# EAGLE board base (EAGLE 9.2.1), part 1 of 3
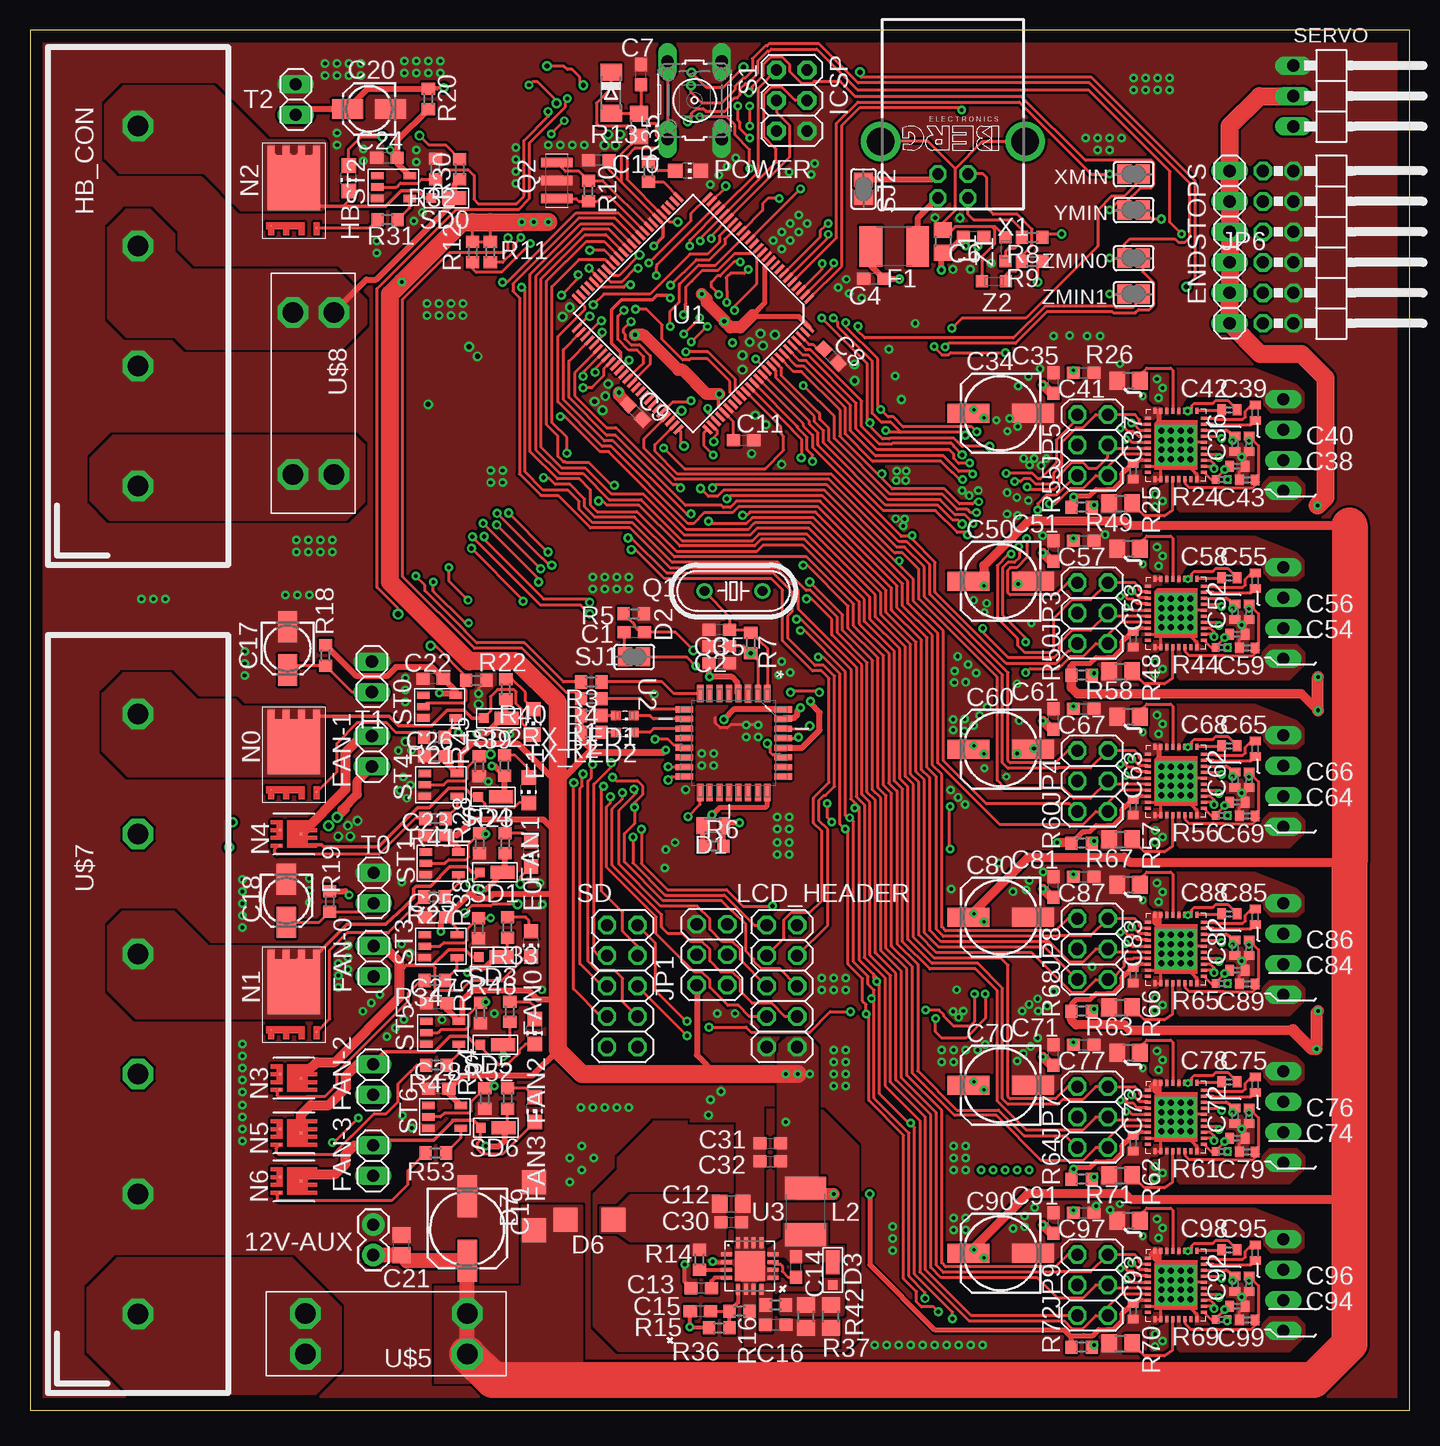
[diagram p5: board, top side]
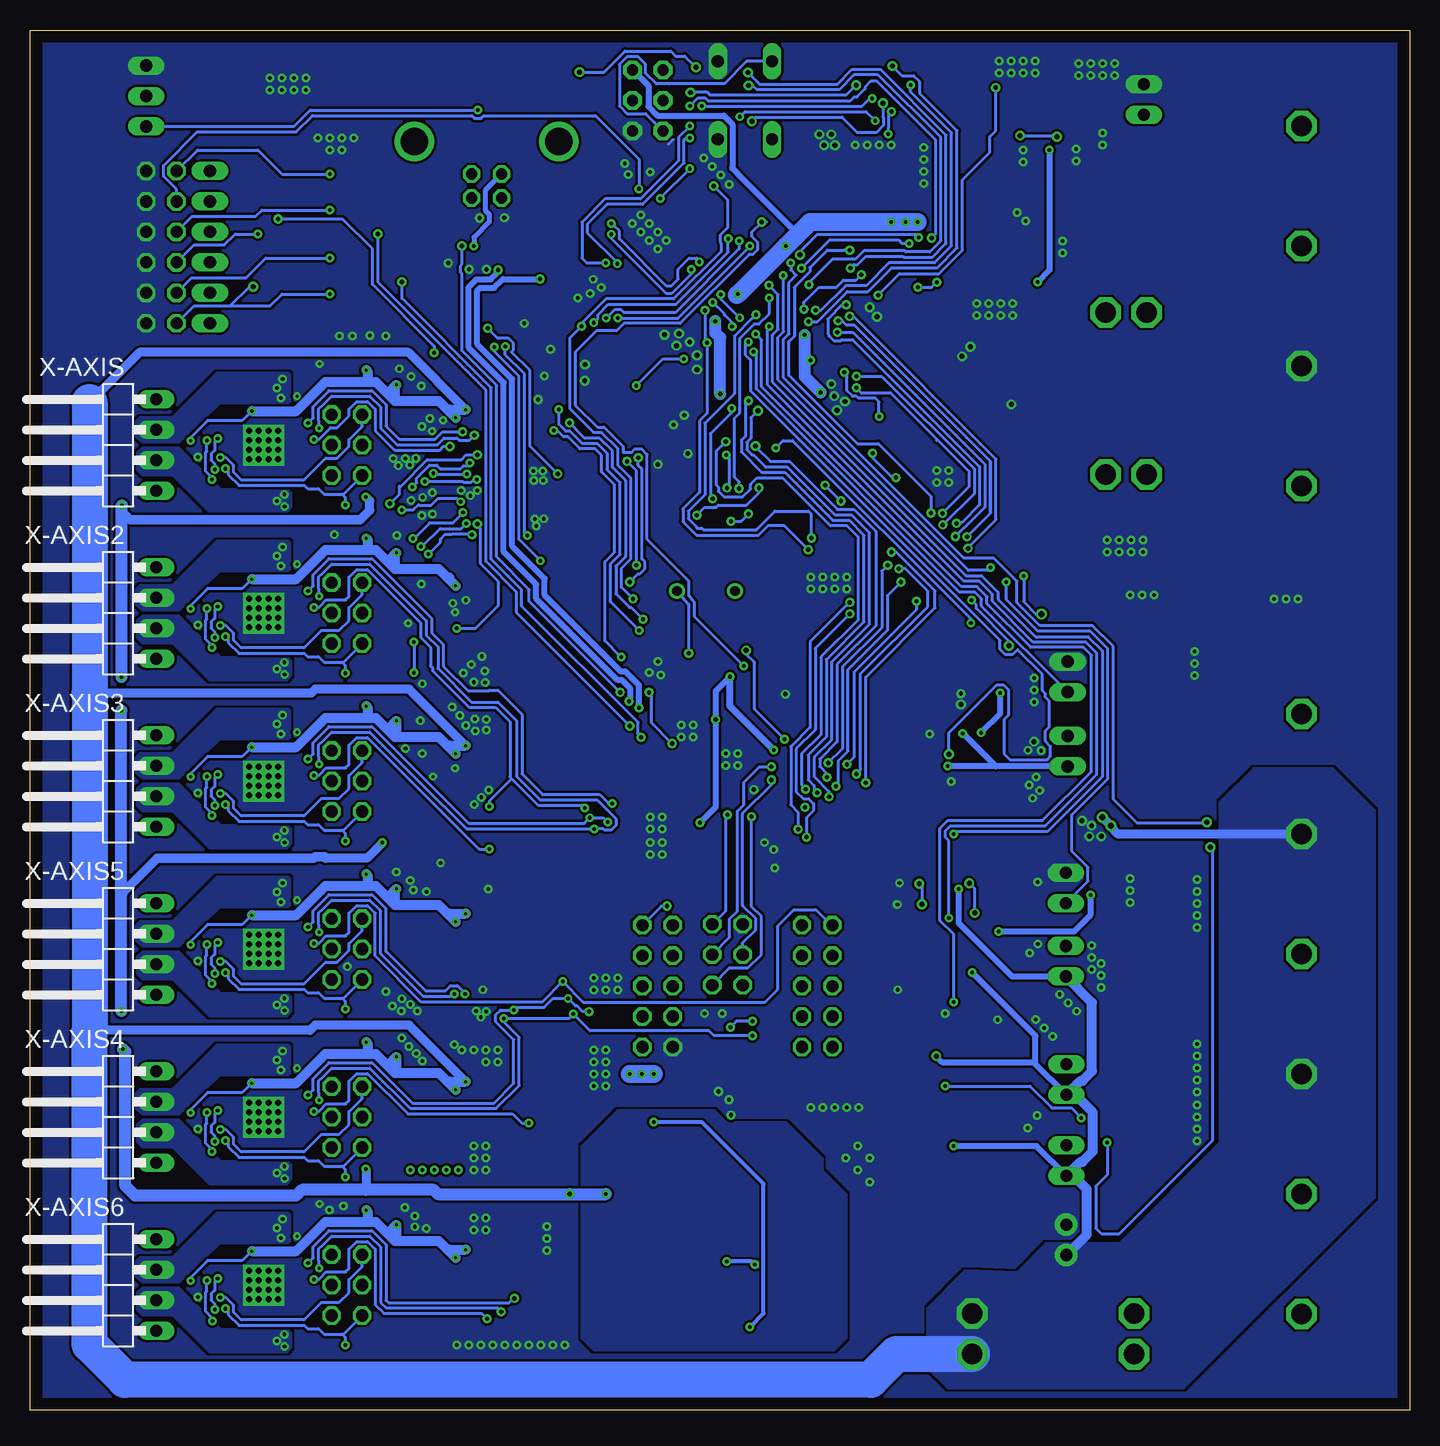
[diagram p6: board, bottom side, seen from below]

Size 115 x 115 mm. Coordinates in mm from the lower left corner, seen from the top.
Outline: 0,0 115,0 115,115 0,115 0,0
Copper layers (1*16): Top 0.035mm / dielectric 1.5mm / Bottom 0.035mm
Design rules "default": minimum track width 6mil, minimum drill 0.35mm, track to track 6mil, track to pad 6mil, pad to pad 6mil, via to via 6mil, smd to smd 6mil, copper to edge 40mil, drill to drill 6mil, minimum pad ring 10mil, minimum via ring 8mil, stop-mask expansion 4mil, vias tented up to drill 0mil, thermal gap 10mil
Net classes: 0 default: width 0.203 mm, drill 0.3 mm, clearance 0.203 mm; 2 gnd: width 0.305 mm, drill 0.406 mm, clearance 0.203 mm; 3 power usb: width 0.508 mm, drill 0.406 mm, clearance 0.203 mm

## Footprints (pad centres in the part's own frame; a part is rotated, then mirrored left to right if it is on the bottom)
1X02 = drill 1.016 pad 1.88: 1 0,0; 2 2.54,0
C0603 = smd 1.1 x 1: 1 -0.85,0; 2 0.85,0
C0805 = smd 1.3 x 1.5: 1 -0.95,0; 2 0.95,0
153CLV-0405 = smd 2.6 x 1.6: + 1.8,0; - -1.8,0
153CLV-0605 = smd 3.5 x 1.6: + 2.7,0; - -2.7,0
C0805' = smd 1.3 x 1.5: 1 -0.85,0; 2 0.85,0
C0402 = smd 0.7 x 0.9: 1 -0.65,0; 2 0.65,0
MICROMELF-W = smd 0.9 x 1.4: A 0.95,0; C -0.95,0
MINIMELF = smd 1.4 x 1.8: A 1.7,0; C -1.7,0
MICROSMP = smd 2 x 1.1: P$1 -1,0 | smd 0.8 x 0.8: P$2 0.9,0
SMA = smd 2 x 2: A -2,0; C 2,0
CHIP-LED0805 = smd 1.2 x 1.2: A 0,-1.05; C 0,1.05
2X06/90 = drill 1.016 octagon: 1 -6.35,-6.35; 2 -6.35,-3.81; 3 -3.81,-6.35; 4 -3.81,-3.81; 5 -1.27,-6.35; 6 -1.27,-3.81; 7 1.27,-6.35; 8 1.27,-3.81; 9 3.81,-6.35; 10 3.81,-3.81; 11 6.35,-6.35; 12 6.35,-3.81
L1812 = smd 1.9 x 3.4: 1 -1.95,0; 2 1.95,0
1X02' = drill 1.016 long: 1 -1.27,0; 2 1.27,0
POWER_CON_4 = drill 1.7 octagon: 1 -15,0; 2 -5,0; 3 5,0; 4 15,0
2X03 = drill 0.95 pad 1.55 octagon: 1 -2.54,-1.27; 2 -2.54,1.27; 3 0,-1.27; 4 0,1.27; 5 2.54,-1.27; 6 2.54,1.27
2X03' = drill 1.016 octagon: 1 -2.54,-1.27; 2 -2.54,1.27; 3 0,-1.27; 4 0,1.27; 5 2.54,-1.27; 6 2.54,1.27
1X06 = drill 1.016 long: 1 -6.35,0; 2 -3.81,0; 3 -1.27,0; 4 1.27,0; 5 3.81,0; 6 6.35,0
R0805 = smd 1.3 x 1.5: 1 -0.95,0; 2 0.95,0
2X05 = drill 1.016 octagon: 1 -5.08,-1.27; 2 -5.08,1.27; 3 -2.54,-1.27; 4 -2.54,1.27; 5 0,-1.27; 6 0,1.27; 7 2.54,-1.27; 8 2.54,1.27; 9 5.08,-1.27; 10 5.08,1.27
TDSON-8FL = smd 0.6 x 0.8: D -1.905,4.95; P$2 1.905,4.95; P$3 -0.635,4.95; P$4 0.635,4.95 | smd 0.1 x 0.1: G 1.9,-1.5; S -1.9,-1.3 | smd 4.41 x 4.55: P$5 0,2.275
TSDSON-8 = smd 0.2 x 0.2: D 0,0.585; G 0.955,-1.15; S -0.345,-1.15
HC49/S = drill 0.813: 1 -2.413,0; 2 2.413,0
CSTCR6M = smd 0.8 x 2.6: 1 -1.5,0; 2 0,0; 3 1.5,0
R0603 = smd 1 x 1.1: 1 -0.85,0; 2 0.85,0
R0402 = smd 0.6 x 0.7: 1 -0.5,0; 2 0.5,0
SML0603 = smd 0.8 x 0.8: A 0.75,0; C -0.75,0
B3F-10XX = drill 1.016 long: 1 -3.251,2.261; 2 3.251,2.261; 3 -3.251,-2.261; 4 3.251,-2.261
1X03/90 = drill 1.016 long: 1 -2.54,-3.81; 2 0,-3.81; 3 2.54,-3.81
SJ = smd 1.168 x 1.6: 1 -0.762,0; 2 0.762,0
SOT23-5 = smd 0.6 x 1.05: P$1 -0.95,-1.35; P$2 0,-1.35; P$3 0.95,-1.35; P$4 0.95,1.35; P$5 -0.95,1.35
100TQFP-ATMEGA2560 = smd 1 x 0.28: P$1 -7.7,6; P$2 -7.7,5.5; P$3 -7.7,5; P$4 -7.7,4.5; P$5 -7.7,4; P$6 -7.7,3.5; P$7 -7.7,3; P$8 -7.7,2.5; P$9 -7.7,2; P$10 -7.7,1.5; P$11 -7.7,1; P$12 -7.7,0.5; P$13 -7.7,0; P$14 -7.7,-0.5; P$15 -7.7,-1; P$16 -7.7,-1.5; P$17 -7.7,-2; P$18 -7.7,-2.5; P$19 -7.7,-3; P$20 -7.7,-3.5; P$21 -7.7,-4; P$22 -7.7,-4.5; P$23 -7.7,-5; P$24 -7.7,-5.5; P$25 -7.7,-6; P$51 7.7,-6; P$52 7.7,-5.5; P$53 7.7,-5; P$54 7.7,-4.5; P$55 7.7,-4; P$56 7.7,-3.5; P$57 7.7,-3; P$58 7.7,-2.5; P$59 7.7,-2; P$60 7.7,-1.5; P$61 7.7,-1; P$62 7.7,-0.5; P$63 7.7,0; P$64 7.7,0.5; P$65 7.7,1; P$66 7.7,1.5; P$67 7.7,2; P$68 7.7,2.5; P$69 7.7,3; P$70 7.7,3.5; P$71 7.7,4; P$72 7.7,4.5; P$73 7.7,5; P$74 7.7,5.5; P$75 7.7,6 | smd 0.28 x 1: P$26 -6,-7.7; P$27 -5.5,-7.7; P$28 -5,-7.7; P$29 -4.5,-7.7; P$30 -4,-7.7; P$31 -3.5,-7.7; P$32 -3,-7.7; P$33 -2.5,-7.7; P$34 -2,-7.7; P$35 -1.5,-7.7; P$36 -1,-7.7; P$37 -0.5,-7.7; P$38 0,-7.7; P$39 0.5,-7.7; P$40 1,-7.7; P$41 1.5,-7.7; P$42 2,-7.7; P$43 2.5,-7.7; P$44 3,-7.7; P$45 3.5,-7.7; P$46 4,-7.7; P$47 4.5,-7.7; P$48 5,-7.7; P$49 5.5,-7.7; P$50 6,-7.7; P$76 6,7.7; P$77 5.5,7.7; P$78 5,7.7; P$79 4.5,7.7; P$80 4,7.7; P$81 3.5,7.7; P$82 3,7.7; P$83 2.5,7.7; P$84 2,7.7; P$85 1.5,7.7; P$86 1,7.7; P$87 0.5,7.7; P$88 0,7.7; P$89 -0.5,7.7; P$90 -1,7.7; P$91 -1.5,7.7; P$92 -2,7.7; P$93 -2.5,7.7; P$94 -3,7.7; P$95 -3.5,7.7; P$96 -4,7.7; P$97 -4.5,7.7; P$98 -5,7.7; P$99 -5.5,7.7; P$100 -6,7.7
QFP80P900X900X120-32N = smd 1.473 x 0.508: 1 -4.115,2.794; 2 -4.115,2.007; 3 -4.115,1.194; 4 -4.115,0.406; 5 -4.115,-0.406; 6 -4.115,-1.194; 7 -4.115,-2.007; 8 -4.115,-2.794; 17 4.115,-2.794; 18 4.115,-2.007; 19 4.115,-1.194; 20 4.115,-0.406; 21 4.115,0.406; 22 4.115,1.194; 23 4.115,2.007; 24 4.115,2.794 | smd 0.508 x 1.473: 9 -2.794,-4.115; 10 -2.007,-4.115; 11 -1.194,-4.115; 12 -0.406,-4.115; 13 0.406,-4.115; 14 1.194,-4.115; 15 2.007,-4.115; 16 2.794,-4.115; 25 2.794,4.115; 26 2.007,4.115; 27 1.194,4.115; 28 0.406,4.115; 29 -0.406,4.115; 30 -1.194,4.115; 31 -2.007,4.115; 32 -2.794,4.115
16QFN = smd 0.896 x 0.32: 2 -1.937,0.325; BOOT 1.937,0.325; DIS 1.937,-0.325; LX 1.937,0.975; SGND 1.937,-0.975; SS -1.937,-0.975; TON -1.937,-0.325; VIN -1.937,0.975 | smd 0.32 x 0.896: 7 0.325,-1.937; 13 0.975,1.937; 14 0.325,1.937; 15 -0.325,1.937; 16 -0.975,1.937; FB -0.975,-1.937; GND -0.325,-1.937; ISEN 0.975,-1.937 | smd 2.5 x 2.5: PAD 0,0
36QFN-TRINAMIC2130 = smd 0.5 x 0.25: 5VOUT 2.35,0.75; - -2.35,-1.75; AIN_IREF 2.35,-0.25; CLK -2.35,2.25; CPI 2.35,2.25; CPO 2.35,1.75; CSN_CFG3 -2.35,1.75; DCIN_CFG5 2.35,-2.25; DIAG0 2.35,-1.75; DIAG1 2.35,-1.25; DIR -2.35,-0.75; DRV_ENN_CFG6 2.35,-0.75; GNDA 2.35,0.25; SCK_CFG2 -2.35,1.25; SDI_CFG1 -2.35,0.75; SDO_CFG0 -2.35,0.25; SPI_MODE -2.35,-2.25; STEP -2.35,-0.25; VCC 2.35,1.25; VCC_IO -2.35,-1.25 | smd 0.25 x 0.5: BRA -0.25,2.85; BRB -0.25,-2.85; DCEN_CFG4 1.75,-2.85; DCO 1.25,-2.85; GNDP1 -1.25,-2.85; GNDP2 -1.25,2.85; NC2 -1.75,-2.85; OA1 -0.75,2.85; OA2 0.25,2.85; OB1 -0.75,-2.85; OB2 0.25,-2.85; TST_MODE -1.75,2.85; VCP 1.75,2.85; VS1 0.75,-2.85; VS2 0.75,2.85; VSA 1.25,2.85 | smd 0.406 x 0.203: GND 0,0 | drill 0.5 pad 0.8 square: P$37 -1.2,1.2; P$38 -0.4,1.2; P$39 0.4,1.2; P$40 1.2,1.2; P$41 -1.2,0.4; P$42 -0.4,0.4; P$43 0.4,0.4; P$44 1.2,0.4; P$45 -1.2,-0.4; P$46 -0.4,-0.4; P$47 0.4,-0.4; P$48 1.2,-0.4; P$49 -1.2,-1.2; P$50 -0.4,-1.2; P$51 0.4,-1.2; P$52 1.2,-1.2
UNIVAL_FUSE = drill 1.7 octagon: P$1 -6.75,1.7; P$2 6.75,1.7; P$3 -6.75,-1.7; P$4 6.75,-1.7
POWER_CON_6 = drill 1.7 octagon: 1 -25,0; 2 -15,0; 3 -5,0; 4 5,0; 5 15,0; 6 25,0
PN61729-S = drill 0.95 octagon: 1 1.25,4.71; 2 -1.25,4.71; 3 -1.25,2.71; 4 1.25,2.71 | drill 2.3 pad 2.9: S1 -6.02,0; S2 6.02,0
1X04/90 = drill 1.016 long: 1 -3.81,-3.81; 2 -1.27,-3.81; 3 1.27,-3.81; 4 3.81,-3.81
CT/CN0603 = smd 1 x 1: 1 -1,0; 2 1,0

## Placement (x,y rotation side)
12V-AUX  [1X02]  28.61,12.91 90 top
C1  100n  [C0603]  50.38,64.8 180 top
C2  22p  [C0603]  57.46,63.63 180 top
C3  22p  [C0603]  57.46,65.03 180 top
C4  100n/0603  [C0603]  70.35,94.26 180 top
C5  100n  [C0603]  57.46,62.23 0 top
C6  1u/0603  [C0603]  78.66,97.78 180 top
C7  22p  [C0603]  50.95,111.28 90 top
C8  100n/0603  [C0603]  66.78,87.82 315 top
C9  100n/0603  [C0603]  50.47,83.18 315 top
C10  100n/0603  [C0603]  47.41,104.14 180 top
C11  100n/0603  [C0603]  59.49,80.8 0 top
C12  2.2u/X5R  [C0805]  58.46,17.2 0 top
C13  47n  [C0603]  55.95,10.14 180 top
C14  22n  [C0603]  63.87,11.91 90 top
C15  10n  [C0603]  55.89,8.25 0 top
C16  1n  [C0603]  62.16,7.09 180 top
C17  10uF/>15V/ø4x 5.8  [153CLV-0405]  21.48,63.47 270 top
C18  10uF/>15V/ø4x 5.8  [153CLV-0405]  21.37,42.44 270 top
C19  100uF/50V/ø5  [153CLV-0605]  36.45,15.13 270 top
C20  10uF/>15V/ø4x 5.8  [153CLV-0405]  28.27,108.42 180 top
C21  100nF/0603  [C0805']  30.96,13.75 90 top
C22  100nv  [C0603]  33.61,60.95 180 top
C23  100n/0603  [C0603]  33.8,47.88 180 top
C24  100n/0603  [C0603]  29.76,104.34 180 top
C25  100n/0603  [C0603]  33.8,41.05 180 top
C26  100n/0603  [C0603]  33.75,54.5 180 top
C27  100n/0603  [C0603]  33.9,33.89 180 top
C28  100n/0603  [C0603]  34.07,26.77 180 top
C30  0.2u/X7R  [C0603]  58.45,15.63 0 top
C31  10u  [C0603]  61.7,22.23 0 top
C32  10u  [C0603]  61.7,20.71 0 top
C34  100uF  [153CLV-0605]  80.91,83.06 180 top
C35  100uF  [C0603]  85.32,85.58 90 top
C36  470n/10V  [C0402]  100.45,80.52 270 top
C37  100n/50V  [C0402]  91.96,78.24 270 top
C38  4n7/10V  [C0402]  100.64,78.65 0 top
C39  22n/50V  [C0402]  102.14,83.1 90 top
C40  100n/50V  [C0402]  101.62,80.52 270 top
C41  1u/50V  [C0603]  87.83,86.43 0 top
C42  100n/50V  [C0402]  99.99,83.35 0 top
C43  100n/50V  [C0402]  101.48,77.51 0 top
C50  100uF  [153CLV-0605]  80.91,69.06 180 top
C51  100uF  [C0603]  85.32,71.58 90 top
C52  470n/10V  [C0402]  100.45,66.52 270 top
C53  100n/50V  [C0402]  91.96,64.24 270 top
C54  4n7/10V  [C0402]  100.64,64.65 0 top
C55  22n/50V  [C0402]  102.14,69.1 90 top
C56  100n/50V  [C0402]  101.62,66.52 270 top
C57  1u/50V  [C0603]  87.83,72.43 0 top
C58  100n/50V  [C0402]  99.99,69.35 0 top
C59  100n/50V  [C0402]  101.48,63.51 0 top
C60  100uF  [153CLV-0605]  80.91,55.06 180 top
C61  100uF  [C0603]  85.32,57.58 90 top
C62  470n/10V  [C0402]  100.45,52.52 270 top
C63  100n/50V  [C0402]  91.96,50.24 270 top
C64  4n7/10V  [C0402]  100.64,50.65 0 top
C65  22n/50V  [C0402]  102.14,55.1 90 top
C66  100n/50V  [C0402]  101.62,52.52 270 top
C67  1u/50V  [C0603]  87.83,58.43 0 top
C68  100n/50V  [C0402]  99.99,55.35 0 top
C69  100n/50V  [C0402]  101.48,49.51 0 top
C70  100uF  [153CLV-0605]  80.91,27.06 180 top
C71  100uF  [C0603]  85.32,29.58 90 top
C72  470n/10V  [C0402]  100.45,24.52 270 top
C73  100n/50V  [C0402]  91.96,22.24 270 top
C74  4n7/10V  [C0402]  100.64,22.65 0 top
C75  22n/50V  [C0402]  102.14,27.1 90 top
C76  100n/50V  [C0402]  101.62,24.52 270 top
C77  1u/50V  [C0603]  87.83,30.43 0 top
C78  100n/50V  [C0402]  99.99,27.35 0 top
C79  100n/50V  [C0402]  101.48,21.51 0 top
C80  100uF  [153CLV-0605]  80.91,41.06 180 top
C81  100uF  [C0603]  85.32,43.58 90 top
C82  470n/10V  [C0402]  100.45,38.52 270 top
C83  100n/50V  [C0402]  91.96,36.24 270 top
C84  4n7/10V  [C0402]  100.64,36.65 0 top
C85  22n/50V  [C0402]  102.14,41.1 90 top
C86  100n/50V  [C0402]  101.62,38.52 270 top
C87  1u/50V  [C0603]  87.83,44.43 0 top
C88  100n/50V  [C0402]  99.99,41.35 0 top
C89  100n/50V  [C0402]  101.48,35.51 0 top
C90  100uF  [153CLV-0605]  80.91,13.06 180 top
C91  100uF  [C0603]  85.32,15.58 90 top
C92  470n/10V  [C0402]  100.45,10.52 270 top
C93  100n/50V  [C0402]  91.96,8.24 270 top
C94  4n7/10V  [C0402]  100.64,8.65 0 top
C95  22n/50V  [C0402]  102.14,13.1 90 top
C96  100n/50V  [C0402]  101.62,10.52 270 top
C97  1u/50V  [C0603]  87.83,16.43 0 top
C98  100n/50V  [C0402]  99.99,13.35 0 top
C99  100n/50V  [C0402]  101.48,7.51 0 top
D1  1206  [MICROMELF-W]  56.94,48.69 180 top
D2  1206  [MINIMELF]  48.45,109.77 270 top
D3  SCHOTTKY  [MICROSMP]  66.92,11.31 270 top
D6  MRA4004T3G  [SMA]  46.66,15.87 0 top
D7  MRA4004T3G  [SMA]  42.02,16.98 270 top
E0  [CHIP-LED0805]  41.77,46.34 180 top
E1  [CHIP-LED0805]  41.97,57.34 180 top
ENDSTOPS  [2X06/90]  109.13,96.91 270 top
F1  500mA/1812  [L1812]  72.04,96.97 180 top
FAN0  [CHIP-LED0805]  41.77,38.84 180 top
FAN1  [CHIP-LED0805]  41.57,51.65 180 top
FAN2  [CHIP-LED0805]  42.07,31.55 180 top
FAN3  [CHIP-LED0805]  42.07,25.05 180 top
FAN-0  [1X02']  28.65,37.4 90 top
FAN-1  [1X02']  28.5,54.9 90 top
FAN-2  [1X02']  28.6,27.53 90 top
FAN-3  [1X02']  28.6,20.78 90 top
HB  [CHIP-LED0805]  26.57,102.64 180 top
HB_CON  POWER_CON_4  [POWER_CON_4]  9,92 90 top
ICSP  3x2M  [2X03]  63.5,109.14 270 top
JP1  [2X03']  56.85,37.95 90 top
JP3  [2X03']  88.58,66.41 90 top
JP4  [2X03']  88.58,52.41 90 top
JP5  [2X03']  88.58,80.41 90 top
JP6  [1X06]  100.01,96.91 270 top
JP7  [2X03']  88.58,24.41 90 top
JP8  [2X03']  88.58,38.41 90 top
JP9  [2X03']  88.58,10.41 90 top
L1  BLM21PG221SH1D  [R0805]  76.09,97.38 270 top
L2  6.3u/1812  [L1812]  64.64,16.55 270 top
LCD_HEADER  [2X05]  62.68,35.33 270 top
N0  BSC010N04LS  [TDSON-8FL]  22,53 0 top
N1  BSC010N04LS  [TDSON-8FL]  22,33 0 top
N2  BSC010N04LS  [TDSON-8FL]  22,100 0 top
N3  BSZ0904NSIATMA1  [TSDSON-8]  22,27.65 270 top
N4  BSZ0904NSIATMA1  [TSDSON-8]  22,48 270 top
N5  BSZ0904NSIATMA1  [TSDSON-8]  22,23.08 270 top
N6  BSZ0904NSIATMA1  [TSDSON-8]  22,19.08 270 top
POWER  [CHIP-LED0805]  54.85,103.27 270 top
Q1  16Mhz  [HC49/S]  58.65,68.26 0 top
Q2  CSTCE16M0V53-R0 16MHZ  [CSTCR6M]  43.92,102.45 90 top
R1  1k/0603  [R0603]  46.78,57.87 180 top
R2  1k/0603  [R0603]  46.78,56.47 180 top
R3  1k/0603  [R0603]  46.78,60.67 180 top
R4  1k/0603  [R0603]  46.78,59.27 180 top
R5  1k/0603  [R0603]  50.33,66.35 180 top
R6  1k/0603  [R0603]  56.95,46.99 0 top
R7  1M/0603  [R0603]  60.09,63.9 270 top
R8  22/0603  [R0603]  83.55,97.73 180 top
R9  22/0603  [R0603]  83.53,95.73 180 top
R10  1M  [R0603]  46.55,101.6 270 top
R11  10k/0603  [R0603]  38.37,96.49 90 top
R12  10k/0603  [R0603]  36.9,96.49 90 top
R13  10k  [R0805]  50.75,107.07 270 top
R14  100k  [R0603]  55.8,12.52 270 top
R15  3.92K  [R0603]  57.46,6.85 0 top
R16  750R  [R0603]  59.14,8.23 0 top
R18  4.7K/0603  [R0603]  24.64,62.89 90 top
R19  4.7K/0603  [R0603]  24.99,42.39 90 top
R20  4.7K/0603  [R0603]  33.21,109.26 270 top
R21  100R/0603/1%  [R0603]  33.71,56.05 180 top
R22  4.7k/0603  [R0603]  37.21,60.8 180 top
R23  1.8K/0603  [R0603]  39.61,47.23 90 top
R24  2R2  [R0402]  99.33,77.53 180 top
R25  0R11/0805/0.1%  [R0805]  90.92,75.55 0 top
R26  0R11/0805/0.1%  [R0805]  91.57,85.78 0 top
R27  100R/0603/1%  [R0603]  33.7,42.75 180 top
R28  4.7k/0603  [R0603]  37.48,47.23 90 top
R30  1.8K/0603  [R0603]  35.82,103.4 90 top
R31  100R/0603/1%  [R0603]  29.81,99.19 180 top
R32  4.7k/0603  [R0603]  33.81,103.41 270 top
R33  1.8K/0603  [R0603]  39.8,40.22 90 top
R34  100R/0603/1%  [R0603]  33.75,35.8 180 top
R35  1K  [R0603]  51.56,103.19 270 top
R36  47R  [R0603]  62.15,8.75 0 top
R37  0R1/.1%/250mW  [R0805]  64.69,7.79 90 top
R38  4.7k/0603  [R0603]  37.4,40.15 90 top
R39  1.8K/0603  [R0603]  39.55,53.7 90 top
R40  1.8K/0603  [R0603]  39.66,60.06 90 top
R41  100R/0603/1%  [R0603]  33.8,49.3 180 top
R42  0R1/.1%/250mW  [R0805]  66.75,7.79 90 top
R44  2R2  [R0402]  99.33,63.53 180 top
R45  4.7k/0603  [R0603]  37.45,53.65 90 top
R46  1.8K/0603  [R0603]  40,33.19 90 top
R47  100R/0603/1%  [R0603]  33.89,28.74 180 top
R48  0R11  [R0805]  90.92,61.55 0 top
R49  0R11  [R0805]  91.57,71.78 0 top
R50  10K  [R0603]  87.67,61.24 0 top
R51  4.7k/0603  [R0603]  37.55,33.09 90 top
R52  1.8K/0603  [R0603]  39.82,25.97 90 top
R53  100R/0603/1%  [R0603]  33.82,21.42 180 top
R54  4.7k/0603  [R0603]  37.92,25.97 90 top
R55  10K  [R0603]  87.67,75.24 0 top
R56  2R2  [R0402]  99.33,49.53 180 top
R57  0R11  [R0805]  90.92,47.55 0 top
R58  0R11  [R0805]  91.57,57.78 0 top
R60  10K  [R0603]  87.67,47.24 0 top
R61  2R2  [R0402]  99.33,21.53 180 top
R62  0R11  [R0805]  90.92,19.55 0 top
R63  0R11  [R0805]  91.57,29.78 0 top
R64  10K  [R0603]  87.67,19.24 0 top
R65  2R2  [R0402]  99.33,35.53 180 top
R66  0R11  [R0805]  90.92,33.55 0 top
R67  0R11  [R0805]  91.57,43.78 0 top
R68  10K  [R0603]  87.67,33.24 0 top
R69  2R2  [R0402]  99.33,7.53 180 top
R70  0R11  [R0805]  90.92,5.55 0 top
R71  0R11  [R0805]  91.57,15.78 0 top
R72  10K  [R0603]  87.67,5.24 0 top
RX_LED1  [SML0603]  49.6,57.87 180 top
S1  [B3F-10XX]  55.4,109.14 270 top
SD  [2X05]  49.38,35.33 270 top
SD0  SCHOTTKY  [MICROSMP]  34.36,100.99 180 top
SD1  SCHOTTKY  [MICROSMP]  38.4,44.8 180 top
SD2  SCHOTTKY  [MICROSMP]  38.71,57.65 180 top
SD3  SCHOTTKY  [MICROSMP]  38.3,37.75 180 top
SD4  SCHOTTKY  [MICROSMP]  38.25,51.1 180 top
SD5  SCHOTTKY  [MICROSMP]  38.45,30.44 180 top
SD6  SCHOTTKY  [MICROSMP]  38.47,23.52 180 top
SERVO  [1X03/90]  109.13,109.5 270 top
SJ1  [SJ]  50.36,62.76 0 top
SJ2  [SJ]  69.48,101.76 270 top
ST0  SN74LVC1G17  [SOT23-5]  34.15,58.61 270 top
ST1  SN74LVC1G17  [SOT23-5]  34.36,45.55 270 top
ST2  SN74LVC1G17  [SOT23-5]  30.31,101.91 270 top
ST3  SN74LVC1G17  [SOT23-5]  34.25,38.65 270 top
ST4  SN74LVC1G17  [SOT23-5]  34.25,52.1 270 top
ST5  SN74LVC1G17  [SOT23-5]  34.4,31.44 270 top
ST6  SN74LVC1G17  [SOT23-5]  34.57,24.42 270 top
T0  [1X02']  28.65,43.5 270 top
T1  [1X02']  28.5,61.1 270 top
T2  [1X02']  22.15,109.2 270 top
TX_LED2  [SML0603]  49.6,56.47 180 top
U1  ATMEGA2560  [100TQFP-ATMEGA2560]  55.27,91.39 225 top
U2  ATMEGA16U2-AU  [QFP80P900X900X120-32N]  58.67,55.58 270 top
U3  A440316QFN  [16QFN]  60,12 0 top
U$2  TRINAMIC2130  [36QFN-TRINAMIC2130]  95.52,80.41 0 top
U$3  TRINAMIC2130  [36QFN-TRINAMIC2130]  95.52,52.41 0 top
U$4  TRINAMIC2130  [36QFN-TRINAMIC2130]  95.52,66.41 0 top
U$5  UNIVAL_FUSE  [UNIVAL_FUSE]  29.7,6.35 180 top
U$6  TRINAMIC2130  [36QFN-TRINAMIC2130]  95.52,24.41 0 top
U$7  POWER_CON_6  [POWER_CON_6]  9,33 90 top
U$8  UNIVAL_FUSE  [UNIVAL_FUSE]  23.62,84.72 270 top
U$9  TRINAMIC2130  [36QFN-TRINAMIC2130]  95.52,38.41 0 top
U$10  TRINAMIC2130  [36QFN-TRINAMIC2130]  95.52,10.41 0 top
X1  PN61729-S  [PN61729-S]  76.94,105.71 180 top
X-AXIS  [1X04/90]  108.29,80.41 90 bottom
X-AXIS2  [1X04/90]  108.29,66.41 90 bottom
X-AXIS3  [1X04/90]  108.29,52.41 90 bottom
X-AXIS4  [1X04/90]  108.29,24.41 90 bottom
X-AXIS5  [1X04/90]  108.29,38.41 90 bottom
X-AXIS6  [1X04/90]  108.29,10.41 90 bottom
XMIN  [SJ]  92,103 0 top
YMIN  [SJ]  92,100 0 top
Z1  VARISTORCN0603  [CT/CN0603]  81.33,96.75 90 top
Z2  VARISTORCN0603  [CT/CN0603]  80.37,94.06 180 top
ZMIN0  [SJ]  92,96 0 top
ZMIN1  [SJ]  92,93 0 top

## Tracks (layer width: path | path; a pad name or v marks a point on that pad's centre or on a via)
16U2_D+  (via drill 0.35)
  Top 0.25: U2.29 63.99,55.99 v64.06,56.06 | v84,94 84,95.34 R9.1
  Bottom 0.25: v84,94 84,92.64 76.55,85.19 76.55,70.9 74,68.35 74,67 64.29,57.29 64.29,56.29 v64.06,56.06
16U2_D-  (via drill 0.35)
  Top 0.25: U2.30 64.27,56.78 64.29,56.76 64.76,56.76 v65,57 | v86,98 84.68,98 R8.1
  Bottom 0.25: v86,98 86,94 77,85 77,70.71 74.45,68.17 74.45,66.45 v65,57
16U2_MISO  (via drill 0.35)
  Top 0.25: v54.85,49.45 55.87,50.47 U2.17
  Bottom 0.25: v54.85,49.45 54.85,41.94 54.04,41.13 54.04,37.95 55.13,36.86 56.67,36.86 JP1.1
16U2_MOSI  (via drill 0.35)
  Top 0.25: v53.2,52.5 53.49,52.79 U2.16
  Bottom 0.25: JP1.4 55.58,38.95 54.49,40.03 54.49,40.94 55.58,42.03 55.58,49.72 53.2,52.1 v53.2,52.5
16U2_RESET  (via drill 0.35)
  Top 0.25: 61.46,51 61.46,51.1 U2.24 | v56.86,49.6 56.9,49.6 56.95,49.65
  Top 0.4: R6.1 56.1,48.59 D1.A 56.95,49.65 57.52,50.22 61.3,50.22 61.46,50.38 61.46,51.1
  Bottom 0.25: JP1.5 57,41.61 57,49.46 v56.86,49.6
16U2_SCK  (via drill 0.35)
  Top 0.25: v53.2,53.6 54.53,53.6 U2.15
  Bottom 0.25: JP1.3 56.67,39.4 56.67,40.94 56.04,41.58 56.04,49.9 55.5,50.44 55.5,52.3 54.2,53.6 v53.2,53.6
16U2_XTAL1
  Top 0.25: Q1.1 58.31,66.06 C3.1 59.91,65.03 R7.1 61.46,63.48 U2.1
16U2_XTAL2  (via drill 0.35)
  Top 0.25: U2.2 60.67,62.47 R7.2 59.51,63.63 C2.1
  Bottom 0.25: Q1.2 60.09,67.16 R7.2
  other vias: 60.09,63.05
+12V  (via drill 0.25, 0.3, 0.3 pad 0.35, 0.41, 0.5)
  Top 0.25: 96.52,83.25 96.82,83.55 96.82,83.65 97.06,83.89 98.61,83.89 98.85,84.13 99.86,84.13 C42.2 | U$2.VS1 96.32,77.51 96.32,77.17 96.64,76.86 99.54,76.86 99.55,76.85 101.93,76.85 102.37,77.29 | 102.37,77.29 102.36,77.3 | 102.4,77.97 102.4,80.36 101.97,80.78 v101.62,80.78 C40.1 | 102.4,77.97 C43.2 | 102.37,77.29 102.4,77.32 102.4,77.97 | R40.1 39.66,59 | 39.66,58.1 39.28,57.72 39.34,57.72 | SD2.P$1 39.51,57.85 | SD5.P$1 40,30.99 R46.1 | SD3.P$1 39.8,38.25 R33.1 | SD6.P$1 39.82,23.87 R52.1 | v96.52,69.25 96.82,69.55 96.82,69.65 97.06,69.89 98.61,69.89 98.85,70.13 99.86,70.13 C58.2 | U$4.VS1 96.32,63.51 96.32,63.17 96.64,62.85 99.54,62.85 99.55,62.85 101.93,62.85 102.37,63.29 | 102.37,63.29 102.36,63.3 | 102.4,63.97 102.4,66.36 101.97,66.78 v101.62,66.78 C56.1 | 102.4,63.97 C59.2 | 102.37,63.29 102.4,63.32 102.4,63.97 | v96.52,55.25 96.82,55.55 96.82,55.65 97.06,55.89 98.61,55.89 98.85,56.13 99.86,56.13 C68.2 | U$3.VS1 96.32,49.51 96.32,49.17 96.64,48.85 99.54,48.85 99.55,48.85 101.93,48.85 102.37,49.29 | 102.37,49.29 102.36,49.3 | 102.4,49.97 102.4,52.35 101.97,52.78 v101.62,52.78 C66.1 | 102.4,49.97 C69.2 | 102.37,49.29 102.4,49.32 102.4,49.97 | v96.52,41.25 96.82,41.55 96.82,41.65 97.06,41.89 98.61,41.89 98.85,42.13 99.86,42.13 C88.2 | U$9.VS1 96.32,35.51 96.32,35.17 96.64,34.85 99.54,34.85 99.55,34.85 101.93,34.85 102.37,35.29 | 102.37,35.29 102.36,35.3 | 102.4,35.97 102.4,38.35 101.97,38.78 v101.62,38.78 C86.1 | 102.4,35.97 C89.2 | 102.37,35.29 102.4,35.32 102.4,35.97 | v96.52,27.25 96.82,27.55 96.82,27.65 97.06,27.89 98.61,27.89 98.85,28.13 99.86,28.13 C78.2 | U$6.VS1 96.32,21.51 96.32,21.17 96.64,20.86 99.54,20.86 99.55,20.85 101.93,20.85 102.37,21.29
  Top 0.25: 102.37,21.29 102.36,21.3 | 102.4,21.97 102.4,24.36 101.97,24.78 v101.62,24.78 C76.1 | 102.4,21.97 C79.2 | 102.37,21.29 102.4,21.32 102.4,21.97 | v96.52,13.25 96.82,13.55 96.82,13.65 97.06,13.89 98.61,13.89 98.85,14.13 99.86,14.13 C98.2 | U$10.VS1 96.32,7.51 96.32,7.17 96.77,6.72 101.81,6.72 102.37,7.29 | 102.37,7.29 102.36,7.3 | 102.4,7.97 102.4,10.36 101.97,10.78 v101.62,10.78 C96.1 | 102.4,7.97 C99.2 | 102.37,7.29 102.4,7.32 102.4,7.97 | C50.+ 78.59,68.68 v79.51,68.68 | C41.1 v86.98,86.65 v86.97,86.66 | C87.1 v86.98,44.65 v86.97,44.66 | C60.+ 78.36,55.06 v78.67,55.37 | C90.+ 78.52,13.37 v78.67,13.37 | C34.+ 78.52,83.37 v78.67,83.37 | C80.+ 78.52,41.37 v78.67,41.37 | C57.1 v86.97,72.66 | C67.1 v86.97,58.66 | C77.1 v86.97,30.66 | C97.1 v86.97,16.66 | C70.+ 78.52,27.37 v78.67,27.37
  Top 0.406: 12V-AUX.1 C21.1
  Top 0.5: v37.24,56.39 38.05,56.39 39.51,57.85 | v37.59,43.4 38,43.4 SD1.P$1 39.61,45.01 R23.1 | v39.45,29.49 SD5.P$1 | v38,22 39.09,22 39.59,22.5 39.59,23.4 SD6.P$1 | v36.45,36.45 36.9,36.9 37.99,36.9 38.84,37.75 SD3.P$1 | SD4.P$1 39.55,51.4 R39.1 | SD2.P$1 39.66,57.7 39.66,58.1 39.66,59
  Top 0.508: v38.51,53.66 38.74,53.66 R39.1
  Top 0.75: C90.+ 83.23,18.08 91.22,18.08 91.72,17.57 110.62,17.57 110.62,15.62 110,15 | 110,45.66 91.63,45.66 91.22,46.08 83.23,46.08 C80.+ | 110,73.71 91.58,73.71 91.22,74.08 83.23,74.08 79.51,70.36 v79.51,68.68 | 26.3,50.1 26,49.8 | 26,49.8 v25.6,49.4 | FAN-1.1 27.29,52.41 27.29,51.31 26,50.02 26,49.8
  Top 0.813: v84.45,85.42 85.14,84.73 C35.1 | v84.45,71.42 85.14,70.73 C51.1 | v84.45,57.42 85.14,56.73 C61.1 | v84.45,43.42 85.14,42.73 C81.1 | v84.45,29.42 85.14,28.73 C71.1 | v84.45,15.42 85.14,14.73 C91.1
  Top 1.27: U$5.P$1 U$5.P$3 C19.+ 31.43,12.43 C21.1 | C21.1 12V-AUX.1
  Top 3: U$5.P$1 38.58,2.52 107,2.52 110,5.52 110,15 110,45.66 110,73.71
  Bottom 0.25: 96.52,83.25 97.33,82.44 100.19,82.44 101.62,81.01 v101.62,80.78 | v96.52,69.25 97.33,68.44 100.19,68.44 101.62,67.01 v101.62,66.78 | v96.52,55.25 97.33,54.44 100.19,54.44 101.62,53.01 v101.62,52.78 | v96.52,41.25 97.33,40.44 100.19,40.44 101.62,39.01 v101.62,38.78 | v96.52,27.25 97.33,26.44 100.19,26.44 101.62,25.01 v101.62,24.78 | v96.52,13.25 97.33,12.44 100.19,12.44 101.62,11.01 v101.62,10.78
  Bottom 0.5: FAN-1.1 34.48,53.63 v37.24,56.39 | FAN-2.1 31.17,28.83 | 31.17,28.83 31.34,29 38.96,29 v39.45,29.49 | FAN-3.1 31.09,22 v38,22 | 31.17,28.83 31.17,31.17 v36.45,36.45 | v37.59,43.4 37.59,40.59 33.13,36.13 FAN-0.1
  Bottom 0.508: 34.48,53.63 38.48,53.63 v38.51,53.66
  Bottom 0.75: 110.03,31.64 91.65,31.64 91.22,32.08 83.38,32.08 v78.67,27.37 | v78.67,83.37 83.44,88.14 105.87,88.14 110.03,83.98 | 110.03,59.75 91.54,59.75 91.22,60.08 83.38,60.08 v78.67,55.37 | v84.45,29.42 84.45,28.21 84.58,28.08 | v84.45,43.42 84.58,43.29 84.58,42.08 | v84.45,57.42 84.45,56.21 84.58,56.08 | v84.45,71.42 84.58,71.29 84.58,70.08 | v84.45,85.42 84.58,85.29 84.58,84.08 | v84.45,15.42 84.45,14.21 84.58,14.08 | U$7.5 24.3,48 24.9,48.6 v24.9,48.7 v25.6,49.4
  Bottom 0.8: v86.97,72.66 86.87,72.56
  Bottom 0.813: 96.52,83.25 v96.5,83.25 92.8,83.25 90.37,85.68 86.87,85.68 | v79.51,82.68 80.12,83.29 | 80.12,83.29 80.04,83.37 v78.67,83.37 | 86.87,85.68 86.18,85.68 85.33,84.83 | 85.33,84.83 84.58,84.08 80.91,84.08 80.12,83.29 | v84.45,85.42 85.04,84.83 85.33,84.83 | v86.97,86.66 86.87,86.56 86.87,85.68 | 12V-AUX.1 26.9,14.62 26.9,18.4 28.01,19.51 FAN-3.1 27.43,20.68 27.27,20.68 26.4,21.55 26.4,24.8 27.86,26.26 FAN-2.1 27.43,27.43 27.27,27.43 26.47,28.23 26.47,33.95 FAN-0.1 | v96.52,69.25 92.8,69.25 90.37,71.68 86.87,71.68 | v79.51,68.68 80.12,69.29 | 80.12,69.29 80.04,69.37 | 86.87,71.68 86.18,71.68 85.33,70.83 | 85.33,70.83 84.58,70.08 80.91,70.08 80.12,69.29 | v84.45,71.42 85.04,70.83 85.33,70.83 | 86.87,72.56 86.87,71.68 | v96.52,55.25 92.8,55.25 90.37,57.68 86.87,57.68 | v79.51,54.68 80.12,55.29 | 80.12,55.29 80.04,55.37 v78.67,55.37 | 86.87,57.68 86.18,57.68 85.33,56.83 | 85.33,56.83 84.58,56.08 80.91,56.08 80.12,55.29 | v84.45,57.42 85.04,56.83 85.33,56.83 | v86.97,58.66 86.87,58.56 86.87,57.68 | v96.52,41.25 92.8,41.25 90.37,43.68 86.87,43.68 | v79.51,40.68 80.12,41.29 | 80.12,41.29 80.04,41.37 v78.67,41.37 | 86.87,43.68 86.18,43.68 85.33,42.83 | 85.33,42.83 84.58,42.08 80.91,42.08 80.12,41.29 | v84.45,43.42 85.04,42.83 85.33,42.83 | v86.97,44.66 86.87,44.56 86.87,43.68 | v96.52,27.25 92.8,27.25 90.37,29.68 86.87,29.68 | v79.51,26.68 80.12,27.29 | 80.12,27.29 80.04,27.37 v78.67,27.37 | 86.87,29.68 86.18,29.68 85.33,28.83 | 85.33,28.83 84.58,28.08 80.91,28.08 80.12,27.29 | v84.45,29.42 85.04,28.83 85.33,28.83 | v86.97,30.66 86.87,30.56 86.87,29.68 | v96.52,13.25 92.8,13.25 90.37,15.68 86.87,15.68
  Bottom 0.813: v79.51,12.68 80.12,13.29 | 80.12,13.29 80.04,13.37 v78.67,13.37 | 86.87,15.68 86.18,15.68 85.33,14.83 | 85.33,14.83 84.58,14.08 80.91,14.08 80.12,13.29 | v84.45,15.42 85.04,14.83 85.33,14.83 | v86.97,16.66 86.87,16.56 86.87,15.68
  Bottom 3: U$5.P$1 42.8,4.65 44.93,2.52 107.08,2.52 110.03,5.47 110.03,31.64 110.03,59.75 110.03,83.98
  pour Top (no thermals): 96.17,83.49 96.84,83.49 96.88,83.45 96.88,83.02 96.87,83.01 96.18,83.01 96.16,83.03 96.16,83.48
  pour Bottom (no thermals): 18.8,1.8 38.5,1.8 40.2,3.5 40.2,8.5 37.1,11.6 36,11.6 32.7,11.5 30.3,13.9 24.2,13.9 15.8,22.3 15.8,50.7 13,53.5 6.4,53.5 2.9,50 2.9,17.7
  pour Top (no thermals): 96.17,69.49 96.84,69.49 96.88,69.45 96.88,69.02 96.87,69.01 96.18,69.01 96.16,69.03 96.16,69.48
  pour Top (no thermals): 96.17,55.49 96.84,55.49 96.88,55.45 96.88,55.02 96.87,55.01 96.18,55.01 96.16,55.03 96.16,55.48
  pour Top (no thermals): 96.17,41.49 96.84,41.49 96.88,41.45 96.88,41.02 96.87,41.01 96.18,41.01 96.16,41.03 96.16,41.48
  pour Top (no thermals): 96.17,27.49 96.84,27.49 96.88,27.45 96.88,27.02 96.87,27.01 96.18,27.01 96.16,27.03 96.16,27.48
  pour Top (no thermals): 96.17,13.49 96.84,13.49 96.88,13.45 96.88,13.02 96.87,13.01 96.18,13.01 96.16,13.03 96.16,13.48
  pour Top (no thermals): 41,17 41,10.25 33.76,10.25 33.76,2.31 46,2.31 46,17
A0  (via drill 0.35)
  Top 0.25: U$2.DIR 90.92,79.66 89.85,78.59 JP5.1 88.85,77.87 87.76,76.78 86.73,76.78 85.48,75.54 v85,75.54 | v77.71,79.59 77,80.29 77,80.36 76.81,80.55 71.89,80.55 71.82,80.48 70.8,80.48 69.32,81.96 69.32,84.1 65.07,88.35 64.67,88.35 U1.P$97
  Bottom 0.25: v85,75.54 84.2,76.33 84.2,77 84.07,77 81.88,79.19 79.02,79.19 78.63,79.59 78.06,79.59 78.02,79.54 77.75,79.54 v77.71,79.59
A1  (via drill 0.3)
  Top 0.25: U$2.STEP 90.1,80.16 JP5.3 89.85,79.41 88.93,78.49 88.23,78.49 87.76,78.96 86.86,78.96 85.77,77.87 85.77,77.1 85.36,76.7 83.34,76.7 v83.11,76.92 | 78,78.88 78.28,78.88 | 78,78.88 77.41,78.88 77,79.3 77,79.65 76.63,80.03 70.61,80.03 68.87,81.77 68.87,83.91 64.88,87.9 64.42,87.9 U1.P$96 | 78,78.88 78.02,78.91 v78.35,78.91
  Bottom 0.25: v78.35,78.91 78.58,78.68 78.87,78.68 79.09,78.45 80.8,78.45 81.09,78.74 81.69,78.74 82.77,77.66 82.77,77.26 v83.11,76.92
A2  (via drill 0.3, 0.3 pad 0.35)
  Top 0.25: JP5.6 87.31,82.59 85.55,80.83 85.55,78.93 84.22,77.6 84.03,77.6 83.58,78.06 v81.37,78.06 | v99.14,79.38 98.86,79.66 U$2.DRV_ENN_CFG6 | v78.59,78 78.36,78.22 77.43,78.22 76.15,79.51 70.49,79.51 68.41,81.59 68.41,83.72 64.69,87.44 64.17,87.44 U1.P$95
  Bottom 0.25: JP5.6 87.31,81.95 88.4,80.86 88.4,80.32 89.4,79.32 90.34,79.32 92.15,77.51 97.38,77.51 98.01,78.14 98.01,78.71 98.68,79.38 v99.14,79.38 | v78.59,78 81.31,78 v81.37,78.06
A3  (via drill 0.3)
  Top 0.25: U$2.CSN_CFG3 92.66,82.16 92.64,82.18 92.5,82.32 92.5,82.54 92.11,82.92 92.11,82.95 JP5.5 88.85,82.95 87.76,81.86 87.22,81.86 86,80.64 86,78.74 85.31,78.06 85.31,77.29 85.17,77.15 83.85,77.15 83.39,77.61 82.83,77.61 82.6,77.38 v82.09,77.38 | v77.75,77.54 77.47,77.54 76.84,78.17 76.83,78.17 75.95,79.05 70.25,79.05 67.96,81.34 67.96,83.53 64.5,86.99 64.12,86.99 | 64.12,86.99 | 64.12,86.99 63.91,86.99 U1.P$94
  Bottom 0.25: v77.75,77.54 78,77.54 78.23,77.31 78.87,77.31 78.93,77.38 v82.09,77.38
A4  (via drill 0.3, 0.3 pad 0.35, 0.35)
  Top 0.25: U$2.DIAG1 98.4,79.16 98.7,78.86 v98.7,78.44 98.48,78.66 U$2.DIAG0 | JP5.2 87.17,77.87 85.55,76.24 84.71,76.24 84,75.54 v84,75.01 | R55.2 88.54,75.24 v88.7,75.4 | 70.67,77.99 67.51,81.15 67.51,83.35 64.32,86.54 64.31,86.54 | 70.67,77.99 71.01,77.65 | XMIN.2 92.15,102.39 92.15,102.06 91.22,101.13 90.17,101.13 89,99.96 89,97 83,91 77.7,91 v76.84,90.14 | 71.01,77.65 v71.01,78.01 70.69,78.01 70.67,77.99 | v79.1,75.69 78.75,75.69 78.57,75.51 77.49,75.51 76.21,76.79 73.29,76.79 73.27,76.77 71.89,76.77 71.01,77.65 | 64.31,86.54 | 64.31,86.54 63.66,86.54 U1.P$93
  Bottom 0.25: v98.7,78.44 98.46,78.2 98.46,77.95 97.57,77.06 92.14,77.06 91.87,76.79 90.95,76.79 90.49,76.33 89,76.33 | 89,76.33 88.85,76.33 JP5.2 | v88.7,75.4 88.7,76.03 89,76.33 | v71,78 v71.01,78.01 73.33,80.33 73.33,86.63 74.85,88.15 74.85,88.19 74.69,88.35 74.69,88.91 75.09,89.31 76.01,89.31 v76.84,90.14 | v84,75.01 83.05,75.01 82.61,75.44 82.55,75.38 81.57,75.38 80.97,75.97 79.39,75.97 79.34,75.93 v79.1,75.69
A5  (via drill 0.3)
  Top 0.25: U$4.DIR 90.92,65.66 89.85,64.59 JP3.1 88.85,63.87 87.76,62.78 86.73,62.78 85.74,61.79 83.36,61.79 v83.01,61.44 | v83,64 83,64.33 81.08,66.25 81.08,70.18 81.54,70.64 82.07,70.64 82.47,71.04 82.47,71.61 82.43,71.64 v82.43,71.97 | v78.64,73.87 78.41,74.1 78.41,74.13 77.94,74.6 77.12,74.6 75.86,75.86 71.51,75.86 66.6,80.78 66.6,81.81 65.85,82.56 65.85,83 65.71,83.13 62.66,86.19 62.66,86.83 U1.P$92
  Bottom 0.25: v83,64 v83,61.45 v83.01,61.44 | 80.81,73.45 80,73.44 | 80.81,73.45 79.06,73.45 v78.64,73.87 | 80.81,73.45 82.3,71.97 v82.43,71.97
A6  (via drill 0.3, 0.35)
  Top 0.25: U$4.STEP 90.1,66.16 JP3.3 88.4,64.96 86.86,64.96 85.77,63.87 85.77,63.1 85.36,62.7 81.56,62.7 79.44,64.82 v79.44,65.14 | v77.71,73.84 77.39,74.15 76.93,74.15 75.67,75.41 71.33,75.41 66.15,80.59 66.15,81.62 65.39,82.37 65.39,82.81 62.19,86.01 62.19,86.25 62.2,86.26 62.2,86.58 U1.P$91
  Bottom 0.25: v77.71,73.84 77.71,73.69 77.45,73.44 77.45,73.12 77.45,73 77.45,72.53 77.45,70.53 75.94,69.01 75.94,67.06 77.86,65.14 v79.44,65.14
A7  (via drill 0.3, 0.3 pad 0.35)
  Top 0.25: 87.31,68.59 JP3.6 86.51,68.95 85.5,67.93 81.72,67.93 81.53,68.12 81.53,70 81.72,70.19 82.26,70.19 83.11,71.04 83.11,72.25 83.08,72.29 v83.08,72.61 | U$4.DRV_ENN_CFG6 98.86,65.66 v99.14,65.38 | v60.5,87.6 60.5,87.57 U1.P$90 | v78.9,74.78 78.4,74.78 78.13,75.06 77.3,75.06 76.04,76.31 71.7,76.31 67.05,80.96 67.05,82.8 64.5,85.36 v64.47,85.36
  Bottom 0.25: JP3.6 87.31,67.95 88.4,66.86 88.4,65.79 89.23,64.96 90.7,64.96 92.15,63.51 97.38,63.51 98.01,64.14 98.01,64.71 98.68,65.38 v99.14,65.38 | v78.9,74.78 79.77,73.91 81.69,73.91 83,72.61 v83.08,72.61 | v64.47,85.36 62.23,87.6 v60.5,87.6
A8  (via drill 0.3, 0.35)
  Top 0.25: 65.66,81.46 64.94,82.18 64.94,82.43 U1.P$89 | 65.66,81.46 | 65.66,81.46 65.69,81.43 65.69,80.4 71.14,74.96 75.48,74.96 77.31,73.13 77.96,73.13 v78.16,72.93 | v81.79,71.32 81.58,71.32 80.62,70.37 80.62,66 82.32,64.31 82.32,63.72 82.89,63.15 85.17,63.15 85.31,63.29 85.31,65.95 86.86,67.5 88.4,67.5 JP3.5 92.08,68.95 92.5,68.54 92.5,68.32 92.61,68.21 93.12,68.21 U$4.CSN_CFG3
  Bottom 0.25: 78.32,72.98 78.16,72.82 v78.16,72.93 78.22,72.99 79.81,72.99 80,72.99 80.38,72.99 80.79,72.58 80.79,72.32 v81.79,71.32
A9  (via drill 0.3, 0.3 pad 0.35, 0.35)
  Top 0.25: JP3.2 86.67,63.23 86.54,63.23 85.55,62.24 81.37,62.24 75.45,68.16 75.45,70.64 73.55,72.55 | U$4.DIAG1 98.4,65.16 98.7,64.86 v98.7,64.44 98.48,64.66 U$4.DIAG0 | U1.P$88 64.45,82.21 64.45,82.03 65.24,81.24 65.24,80.21 72.64,72.81 73.29,72.81 73.55,72.55 | v94.32,99.25 93.51,99.25 YMIN.2 | 73.55,72.55 v73.55,72.87 | v81.31,88.11 76.77,88.11 76.58,87.92 76.02,87.92 75.38,88.56 v75.38,88.63 | R50.2 88.54,61.24 v88.7,61.4
  Bottom 0.25: v98.7,64.44 98.46,64.2 98.46,63.95 97.57,63.06 92.14,63.06 91.87,62.79 90.95,62.79 90.49,62.33 89,62.33 | 89,62.33 88.85,62.33 JP3.2 | v88.7,61.4 88.7,62.03 89,62.33 | v81.31,88.11 81.31,88.66 86.45,93.81 86.45,96.75 88.95,99.25 v94.32,99.25 | v73.55,72.87 73.78,73.1 73.78,86.33 75.38,87.93 v75.38,88.63
A10  (via drill 0.3 pad 0.35, 0.35)
  Top 0.25: 87.31,12.59 JP9.6 86.51,12.95 85.5,11.93 76.32,11.93 76,12.26 76,24.97 73.09,27.88 73.09,36.75 71.37,38.47 71.37,51.19 70.69,51.87 70.69,62.67 68.2,65.16 68.2,67 64.81,70.39 v64.45,70.39 | U$10.DRV_ENN_CFG6 98.86,9.66 v99.14,9.38 | U1.P$87 64,81.95 64,81.84 64.79,81.05 64.79,80.02 65.23,79.58 v65.23,79.05
  Bottom 0.25: JP9.6 87.31,11.95 88.4,10.86 88.4,9.79 89.23,8.96 90.7,8.96 92.15,7.51 97.38,7.51 98.01,8.14 98.01,8.71 98.68,9.38 v99.14,9.38 | v64.45,70.39 64.45,78.27 v65.23,79.05
A11  (via drill 0.35)
  Top 0.25: v65,69 67.75,66.25 67.75,64.97 70.24,62.48 70.24,51.68 70.92,51 70.92,38.28 72.64,36.56 72.64,27.69 75.55,24.79 75.55,12.07 76.14,11.48 85.68,11.48 85.7,11.5 88.4,11.5 JP9.5 92.08,12.95 92.5,12.54 92.5,12.32 92.66,12.16 U$10.CSN_CFG3 | v64.29,79.36 64.29,80.91 63.55,81.66 63.55,81.7 U1.P$86
  Bottom 0.25: v65,69 64.32,69.68 64.16,69.68 63.74,70.1 63.74,70.68 64,70.94 64,78.45 64.29,78.75 v64.29,79.36
A12  (via drill 0.3)
  Top 0.25: C18.+ 24.08,40.64 R19.1 27.96,41.54 T0.2 | v52.82,80.18 54.55,78.45 61.3,78.45 62.83,79.98 62.83,81.12 62.59,81.37 62.59,81.95 U1.P$85 | v36.56,65.6 36.26,65.6 33.62,68.24 v33.62,68.99
  Bottom 0.25: T0.2 26.8,44.08 26.8,45.22 28.16,46.58 28.16,49.6 25.16,52.6 25.16,63.44 26.62,64.91 31,64.91 33.62,67.53 v33.62,68.99 | v52.82,80.18 52.22,80.78 51.42,80.78 36.56,65.92 v36.56,65.6
A13  (via drill 0.3)
  Top 0.25: T1.2 26.85,59.83 R18.1 21.84,62.04 C17.+ | U1.P$84 58.8,85.03 58.8,85.9 56.51,88.19 v54.68,88.19
  Bottom 0.25: T1.2 35.67,67 35.67,67.6 36.24,68.16 37.52,68.16 54.46,85.1 54.46,87.96 v54.68,88.19
A14  (via drill 0.35)
  Top 0.25: 33.23,110.13 R20.1 | R20.1 34,110.11 | v45.7,94.6 45.7,94.3 v44.3,92.9 | v34.5,110.2 33.3,110.2 R20.1 | v50.48,91.73 51.4,91.73 52.69,90.43 52.69,89.22 54.4,87.5 54.97,87.5 55.06,87.6 56.46,87.6 58.35,85.71 58.35,84.78 U1.P$83
  Top 0.5: T2.2 22.64,108.42 C20.+ 28.16,110.11 R20.1
  Bottom 0.25: v45.7,94.6 46.15,94.15 47.19,94.15 47.79,93.55 49.25,93.55 50.48,92.32 v50.48,91.73 | v44.3,92.9 42.51,94.69 39.22,94.69 37.27,96.65 37.27,102.53 35,104.8 35,106.1 34.5,106.6 v34.5,110.2
AREF
  Top 0.25: C8.1 65.64,88.42 65.26,88.8 64.93,88.8 U1.P$98
D0  (via drill 0.3, 0.35)
  Top 0.25: R4.2 45.41,59.8 44.7,59.8 41.02,63.47 37.05,63.47 31.08,69.45 31.08,92.55 35,96.47 39.6,96.47 39.84,96.71 v39.84,97.67 | v67,95.6 67,95.34 U1.P$2 | v59.98,108.67 v59.98,107.01 v59.99,107
  Bottom 0.25: v67,95.6 68.6,95.6 69,96 69,99 67.08,100.92 64.11,100.92 60.93,104.11 60.93,106.06 v59.99,107 | v59.98,108.67 59.3,109.35 58.71,109.35 58.47,109.11 46.59,109.11 46.27,109.43 46.05,109.43 45.39,110.09 45.39,110.24 44.92,110.71 44.39,110.71 39.54,105.86 39.54,97.97 v39.84,97.67
D1  (via drill 0.3, 0.5)
  Top 0.25: R3.2 44.46,60.67 41.21,63.92 37.24,63.92 36.23,64.93 36.23,64.96 32.94,68.26 32.94,68.72 v32.16,69.5 | U1.P$3 66.03,95.07 v66.03,95.53 | v44.81,109.28 44.89,109.19 44.63,108.94 44.63,108.6 41.63,105.6 41.63,100.96 40.75,100.08 35.55,100.08 28.92,93.45 28.92,68.55 30.68,66.8 v30.68,66.33 | v59.99,106 59.2,106.79 59.2,107.29 59.01,107.48 v59.01,108.67
  Bottom 0.25: v66.03,95.53 66.03,95.59 68.55,98.11 68.55,98.81 66.89,100.47 63.93,100.47 60.48,103.92 60.48,105.84 60.31,106 v59.99,106 | v44.81,109.28 45.01,109.28 45.63,108.66 v59,108.66 v59.01,108.67 | v32.16,69.5 32.16,67.36 31.13,66.33 v30.68,66.33
D2  (via drill 0.3, 0.41)
  Top 0.25: 37.65,54.7 R45.2 38.25,54.5 v38.39,54.64 | v66.55,97.98 66.55,97.72 U1.P$6 | v55.14,89.02 56.4,90.28 v56.48,90.28 | 58.08,94.28 58.08,94.42 58.38,94.72 59.56,94.72 v59.87,95.03 | 58.1,94.3 58.08,94.28 | 58.08,94.28 58.08,93.28 58.11,93.25 58.11,92.68 58.08,92.65 v58.08,92.31
  Top 0.254: ST4.P$2 34.49,52.1 34.81,52.42 36.26,52.42 36.45,52.61 36.45,53.51 R45.2
  Bottom 0.25: v59.87,95.03 59.87,94.69 61.52,93.04 61.95,93.04 66.55,97.64 v66.55,97.98 | v55.14,89.02 55.37,88.79 55.37,87.9 54.97,87.5 54.91,87.5 54.91,84.91 34.13,64.13 34.13,63.38 33.7,62.95 33.09,62.95 32.67,63.36 30.62,61.31 30.62,59.95 30.35,59.68 30.35,59.38 30.04,59.06 30.04,56.94 30.35,56.62 30.35,55.72 29.92,55.28 29.92,54.52 30.23,54.21 33.31,54.21 33.8,54.7 33.8,57.53 33.44,57.89 33.44,60.02 33.84,60.42 34.4,60.42 38.39,56.43 v38.39,54.64 | v56.48,90.28 56.48,90.64 57.1,91.27 57.1,91.36 57.62,91.87 57.64,91.87 v58.08,92.31
D3  (via drill 0.3)
  Top 0.25: ST5.P$2 34,31.44 34.28,31.73 36.38,31.73 36.6,31.95 36.6,32.99 R51.2 37.61,34 v38,34 | v54.49,89.66 55.83,91 v55.83,91.02 | U1.P$7 65.87,97.74 65.87,98.26 66.27,98.66 66.32,98.66 v66.55,98.89 | v59.2,95.69 58.7,95.69 57.52,94.51 57.31,94.51 56.8,94 56.8,93.59 v57.43,92.97
  Bottom 0.25: v38,34 38,39.64 39.13,40.77 39.13,48.47 38.47,49.13 30.59,49.13 26.52,53.2 26.52,62.88 27.19,63.55 31.58,63.55 35.22,67.19 35.22,67.78 36.05,68.62 37.34,68.62 54,85.28 54,89.17 v54.49,89.66 | v55.83,91.02 57.43,92.62 v57.43,92.97 | v66.55,98.89 66.32,98.66 66.27,98.66 65.87,98.26 65.87,97.6 61.92,93.65 61.55,93.65 60.98,94.23 60.98,95.08 60.05,96 59.41,96 59.2,95.79 v59.2,95.69
D4  (via drill 0.3)
  Top 0.25: U1.P$1 67.68,95.32 67.68,107.04 69.19,108.55 77.44,108.55 v77.67,108.32
  Bottom 0.25: SERVO.3 93,106.96 91.64,108.32 v77.67,108.32
D5  (via drill 0.3)
  Top 0.25: XMIN.1 v90,103 88.48,103 82.48,109 69,109 67.23,107.23 67.23,97.69 U1.P$5
  Bottom 0.25: ENDSTOPS.1 101.03,105 96,105 94,103 v90,103
D6  (via drill 0.3)
  Top 0.25: v64.23,101.77 U1.P$15
  Bottom 0.25: ENDSTOPS.3 102.78,101.71 103.87,102.8 103.87,103.71 101.07,106.51 92.81,106.51 91.45,107.86 78.18,107.86 77.95,107.64 77.39,107.64 77.16,107.86 67.86,107.86 64.23,104.23 v64.23,101.77
D7  (via drill 0.3)
  Top 0.25: ST3.P$2 34.2,38.65 34.51,38.95 36.24,38.95 36.45,39.16 36.45,40.05 R38.2 v38.4,41 | 53.37,90.48 v53.37,90.3 53.37,91.58 54.14,92.35 54.14,93.82 55.73,95.41 57.15,95.41 59.63,97.89 U1.P$16
  Bottom 0.25: v38.4,41 38.4,47.43 38.68,47.72 38.68,48.28 38.28,48.68 30.36,48.68 26.07,52.98 26.07,63.07 27,64 31.38,64 34.76,67.39 34.76,67.97 35.86,69.07 37.15,69.07 53.55,85.47 53.55,90.12 v53.37,90.3
D8  (via drill 0.3, 0.35)
  Top 0.25: v59.99,103.44 59.99,105.04 58.75,106.28 58.75,107.1 58.08,107.77 v55.83,107.77 | U1.P$17 59.34,98.25 61.07,99.97 61.07,100.53 61.5,100.97 v62.47,100.97 | v44.54,107.44 v44.54,107.43 v43.45,106.34 | 32.61,102.53 32.65,102.56 R32.2 34.62,103.37 36.51,103.37 36.98,102.9 37,102.9 37,100.9 37.37,100.53 40.56,100.53 41.18,101.15 41.18,105.78 43.19,107.8 v43.19,108.2
  Top 0.254: ST2.P$2 30.55,101.91 30.87,102.23 32.32,102.23 32.61,102.53
  Bottom 0.25: v44.54,107.44 45.31,108.21 55.39,108.21 v55.83,107.77 | v59.99,103.44 v62.47,100.97 | v43.45,106.34 43.45,106.83 43.41,106.87 43.41,107.99 v43.19,108.2
D9  (via drill 0.3, 0.35)
  Top 0.25: R28.2 37.56,48 v38,48 | U1.P$18 57.93,97.58 57.93,97.14 56.66,95.86 55.55,95.86 v53.4,93.72
  Top 0.254: ST1.P$2 34.6,45.55 34.92,45.87 36.37,45.87 36.56,46.06 36.56,47.16 R28.2
  Bottom 0.25: v38,48 37.8,48.2 30.2,48.2 25.61,52.79 25.61,63.25 26.81,64.45 31.19,64.45 34.31,67.58 34.31,68.16 35.67,69.52 36.96,69.52 53.1,85.66 53.1,89.58 52.63,90.05 52.63,92.95 v53.4,93.72
D10  (via drill 0.3, 0.41)
  Top 0.25: ST0.P$2 33.12,58.93 36.16,58.93 36.35,59.12 36.35,60 36.16,60.19 36.16,60.6 R22.2 36.54,60.94 33.89,63.59 33.49,63.59 v33.39,63.68 | v36.52,67.48 34.93,69.07 v34.93,70.2 | v52.21,94.54 52.21,95.25 52.26,95.29 52.26,95.45 U1.P$23
  Bottom 0.25: v36.52,67.48 36.12,67.09 36.12,66.81 33.39,64.08 v33.39,63.68 | v34.93,70.2 35.16,69.98 36.77,69.98 52.64,85.85 52.64,89.4 52.18,89.86 52.18,94.51 v52.21,94.54
D11  (via drill 0.3 pad 0.35, 0.35)
  Top 0.25: U$10.DIAG1 98.4,9.16 98.7,8.86 v98.7,8.44 98.48,8.66 U$10.DIAG0 | JP9.2 78.46,7.87 74.64,11.69 74.64,24.41 71.73,27.32 71.73,36.19 70.02,37.91 70.02,50.63 69.33,51.31 69.33,62.1 66.84,64.59 66.84,65.88 65.13,67.59 v64.74,67.59 | U1.P$24 58,101.9 v58,102 | ZMIN1.2 92.15,92.39 92.15,92.06 91.96,91.87 90.52,91.87 90.39,92 84.64,92 81.97,89.33 69.59,89.33 69.02,89.9 v69.02,90.32 | R72.2 88.68,5.4 v88.7,5.4
  Bottom 0.25: v98.7,8.44 98.46,8.2 98.46,7.96 97.57,7.06 92.14,7.06 91.87,6.79 90.95,6.79 90.49,6.33 89,6.33 | 89,6.33 88.85,6.33 JP9.2 | v88.7,5.4 88.7,6.03 89,6.33 | v58,102 56.85,100.85 56.85,98.53 57.47,97.91 57.47,97.32 57.42,97.27 57.42,96.51 61.34,92.59 66.98,92.59 69.02,90.55 v69.02,90.32 70,89.34 70,83.45 68.04,81.49 68.04,81.45 67.34,81.45 66,80.11 66,78.75 64.9,77.65 64.9,70.94 65.71,70.13 65.71,68.55 v64.74,67.59
D12  (via drill 0.3, 0.41)
  Top 0.25: ST6.P$2 34.2,24.42 34.52,24.74 36.58,24.74 36.77,24.93 36.77,25.67 R54.2 38.1,27 v38.71,27 | v27.36,24.33 25.34,22.3 v25.2,22.3 | U1.P$25 55.11,99.71 55.11,99.11 v51.58,95.58 | v16.6,46.9 16.6,48.69 v16.9,48.98
  Bottom 0.25: v27.36,24.33 28.21,25.17 29.81,25.17 31.64,27 v38.71,27 | 51.73,95.42 v51.58,95.58 51.58,95.02 51.13,94.57 51.73,93.97 51.73,89.67 52.19,89.21 52.19,86.03 37.15,71 34.66,71 32.73,69.06 32.73,67.27 30.81,65.36 26.44,65.36 24.71,63.63 24.71,50.91 22.7,48.9 16.9,48.9 v16.9,48.98 | v25.2,22.3 25.2,19.6 26.16,18.64 26.16,15.16 25.7,14.7 24.2,14.7 16.4,22.5 16.4,46.6 16.7,46.9 v16.6,46.9
D13
  Top 0.25: R35.2 52.8,102.34 U1.P$26
D14  (via drill 0.3, 0.35, 0.41)
  Top 0.25: YMIN.1 v90,100 90.67,100.67 91.4,100.67 92.6,101.87 93.48,101.87 93.67,102.06 93.67,103.94 93.48,104.13 87.99,104.13 82.67,109.45 68.81,109.45 67.53,110.73 65.39,110.73 65.23,110.57 64.31,110.57 63.33,111.55 63.33,112.13 62.69,112.78 61.77,112.78 61.13,112.13 61.13,111.22 60.22,110.31 60.22,110.07 v59.94,109.79 | v43.1,112 44.52,112 44.8,111.71 45.18,111.71 45.84,111.05 45.84,110.67 v46.12,110.39 | 50.18,90.62 v50.1,90.7 49.46,90.06 49.46,89.8 49.6,89.66 49.6,89.26 50.09,88.77 50.79,88.77 51.7,87.86 51.7,87.16 50.18,85.64 U1.P$64
  Bottom 0.25: ENDSTOPS.5 101.48,99.47 96.19,99.47 95.66,100 v90,100 | v43.1,112 42.3,111.2 41.34,111.2 40.82,110.68 40.82,109.7 37.72,106.61 37.72,96.84 39.41,95.15 43.2,95.15 45.15,93.2 46.86,93.2 49.36,90.7 v50.1,90.7 | v46.12,110.39 v46.12,110.38 46.16,110.38 46.97,109.58 58.3,109.58 58.52,109.81 59.92,109.81 v59.94,109.79
D15  (via drill 0.3, 0.35, 0.41)
  Top 0.25: v96,98 95.03,98.97 95.03,103.22 88.25,110 69,110 65.6,113.4 61.8,113.4 61.63,113.23 61.48,113.23 60.67,112.42 60.67,111.4 59.8,110.53 59.63,110.53 59.2,110.1 59.2,109.6 58.95,109.35 58.73,109.35 58.33,108.95 58.33,108.63 57.92,108.22 56.34,108.22 56.11,108.45 55.55,108.45 55.15,108.05 55.15,107.72 v54.82,107.4 | v43.9,108.9 43.9,109.1 42.3,110.7 41.9,110.7 v41.6,110.4 | v49.51,91.65 49.01,91.15 49.01,89.21 49.9,88.32 50.6,88.32 51.15,87.77 51.15,87.25 51,87.1 50.98,87.1 U1.P$63
  Bottom 0.25: v96,98 97.88,98 98.79,97.08 101.33,97.08 ENDSTOPS.7 | v41.6,110.4 41.6,109.85 38.17,106.42 38.17,97.03 39.6,95.6 43.39,95.6 45.29,93.7 47,93.7 49.05,91.65 v49.51,91.65 | v54.82,107.4 54.48,107.74 47.3,107.74 46.02,106.46 44.46,106.46 43.86,107.06 43.86,107.72 43.9,107.76 v43.9,108.9
D16  (via drill 0.35)
  Top 0.25: U1.P$13 60.25,96.37 58.75,96.37 57.34,94.96 56.05,94.96 55.43,94.33 55.35,94.25 55.2,94.1 54.66,93.57 54.66,92.18 54.59,92.11 54.59,91.39 v54.48,91.28 | LCD_HEADER.4 66.5,40.41 66.5,48.38 65.78,49.1 65.78,50.83 66.17,51.23 66.33,51.23 67.07,51.97 67.07,61.15 66.17,62.05 65.43,62.05 63.19,64.3 63.19,66.19 63.56,66.56 63.56,68.16 61.98,69.74 53.09,69.74 50.16,72.66 v49.86,72.66
  Bottom 0.25: v54.48,91.28 54.8,90.96 56.27,89.49 56.27,84.7 58.73,82.24 58.73,76.29 60.12,74.91 60.12,74.28 59.4,73.56 59.4,73.5 58.99,73.5 58.85,73.36 54.44,73.36 52.9,74.9 50.11,74.9 49.86,74.65 v49.86,72.66
D17  (via drill 0.35)
  Top 0.25: v58.73,91.63 58.73,92 60.55,93.82 60.55,95.97 U1.P$12 | LCD_HEADER.3 62.86,39.31 62.86,40.86 63.5,41.49 65.04,41.49 66,42.45 66,48.23 65.32,48.91 65.32,51.01 66.61,52.31 66.61,60.97 65.98,61.6 65.25,61.6 62.74,64.11 62.74,68.34 61.8,69.28 52.9,69.28 50.48,71.7 v50.12,71.7
  Bottom 0.25: v58.73,91.63 58.73,89.1 v58.56,88.94 58.56,83.05 59.19,82.43 59.19,76.48 60.57,75.1 60.57,74.03 59.45,72.91 54.25,72.91 53.46,73.7 52.12,73.7 v50.12,71.7
D18  (via drill 0.3, 0.35, 0.41)
  Top 0.25: v90,96 ZMIN0.1 91.24,97.14 91.7,97.6 95.44,97.6 95.72,97.32 96.28,97.32 96.56,97.6 96.6,97.6 96.6,97.64 96.68,97.72 96.68,102.22 88.3,110.6 69.04,110.6 65.79,113.85 61.61,113.85 61.45,113.69 61.3,113.69 60.22,112.61 60.22,111.59 59.62,110.99 59.45,110.99 58.75,110.29 58.75,110.02 57.64,108.9 56.3,108.9 56,108.9 55.1,109.81 v55.1,110.37 | v50.07,93.77 49.71,93.77 49.49,93.55 47.46,93.55 U1.P$46
  Bottom 0.25: ENDSTOPS.9 101.53,94.35 97,94.35 95.35,96 v90,96 | v55.1,110.37 54.75,110.37 54.41,110.03 47.52,110.03 46.29,111.26 44.3,111.26 39.08,106.04 39.08,97.4 39.11,97.4 39.99,96.52 41.98,96.52 42.06,96.6 45.5,96.6 46.2,95.9 48.1,95.9 50.07,93.93 v50.07,93.77
D19  (via drill 0.3, 0.35, 0.41)
  Top 0.25: v90,93 ZMIN1.1 | v96.4,93.6 97.14,94.33 97.14,102.41 88.49,111.05 69.3,111.05 69.19,111.16 v69.19,111.49 | v59.49,111.89 57.79,110.2 56.41,110.2 v55.15,111.45 | U1.P$45 47.35,94.41 46.92,94.83 46.92,94.84 v46.6,95.16
  Bottom 0.25: ENDSTOPS.11 101.33,92 98.3,92 | v90,93 94,93 95,92 98.3,92 | 98.3,92 96.7,93.6 v96.4,93.6 | v69.19,111.49 67.16,111.49 65.42,113.23 61.58,113.23 61.17,112.83 60.42,112.83 v59.49,111.89 | v55.15,111.45 54.81,111.11 54.8,111.11 54.37,110.67 54.2,110.5 47.7,110.5 46.48,111.71 44.11,111.71 38.63,106.23 38.63,97.21 39.77,96.06 42.17,96.06 42.23,96.13 45.33,96.13 46.01,95.45 46.31,95.45 v46.6,95.16
D22  (via drill 0.3, 0.35)
  Top 0.25: U$3.DIR 90.92,51.66 89.85,50.59 JP4.1 88.85,49.87 87.76,48.78 80.83,48.78 75.68,53.94 75.68,64.73 73.19,67.22 73.19,69.06 66.06,76.19 58.34,76.19 v58.09,75.93 | v56.5,83.48 56.5,83.09 U1.P$78
  Bottom 0.25: v58.09,75.93 58.28,76.12 58.28,81.36 56.5,83.14 v56.5,83.48
D23  (via drill 0.35)
  Top 0.25: v57,80.7 57,81.06 57.25,81.31 57.25,81.63 U1.P$77 | LCD_HEADER.5 59.21,37.52 59.21,38.4 58.58,39.04 57.7,39.04 56.67,40.06 56.67,40.94 55.61,42 52.58,42 49.1,45.48 49.1,49.96 50.54,51.4 50.54,51.54 v50.34,51.74
  Bottom 0.25: 57.33,80.37 v57,80.7 57.8,79.9 57.8,77.1 57.61,76.91 57.61,76.55 57.14,76.08 55.6,76.08 54.94,76.74 54.94,77.13 54.38,77.69 52.26,77.69 48.26,73.68 46.89,73.68 45.95,72.75 45.95,65.87 49.06,62.76 49.06,62.72 49.07,62.71 49.07,56.29 50.67,54.69 50.67,52.09 50.34,51.76 v50.34,51.74
D24  (via drill 0.3, 0.35)
  Top 0.25: U$3.STEP 90.1,52.16 JP4.3 88.4,50.96 87,50.96 86.14,51.82 81.28,51.82 80.62,52.48 80.62,61.07 74.09,67.6 74.09,70.08 72.72,71.45 72.16,71.45 72.12,71.41 66.44,77.09 57.15,77.09 v56.9,76.84 | v56.96,79.58 56.2,80.34 56.2,81.43 U1.P$76
  Bottom 0.25: v56.96,79.58 56.72,79.33 56.72,77.03 v56.9,76.84
D25  (via drill 0.35, 0.41)
  Top 0.25: U1.P$75 54.23,81.54 54.23,80.61 v54.51,80.33 | LCD_HEADER.6 62.5,36.77 60.96,36.77 60.32,37.41 60.32,37.58 59.67,38.23 59.67,40.48 58.58,41.58 58.52,41.58 57.65,42.45 52.77,42.45 49.55,45.67 49.55,48.03 50.39,48.87 50.39,50.1 v50.39,50.23 50.39,50.62 51.05,51.27 51.05,52.03 50.63,52.45 48.85,52.45 v48.57,52.73
  Bottom 0.25: v54.51,80.33 54.51,80.27 53.29,79.05 51.7,79.05 47.69,75.04 46.32,75.04 44.5,73.22 44.5,65.34 47.71,62.13 47.71,55.69 49.17,54.23 49.17,53.63 48.57,53.03 v48.57,52.73
D26  (via drill 0.3 pad 0.35)
  Top 0.25: 87.31,54.59 JP4.6 86.51,54.95 85.5,53.93 81.72,53.93 81.53,54.12 81.53,61.44 75,67.97 75,70.46 73.1,72.36 72.45,72.36 66.81,78 53.99,78 52.1,79.9 52.1,80.44 U1.P$74 | U$3.DRV_ENN_CFG6 98.86,51.66 v99.14,51.38
  Bottom 0.25: JP4.6 87.31,53.95 88.4,52.86 88.4,51.79 89.23,50.96 90.7,50.96 92.15,49.51 97.38,49.51 98.01,50.14 98.01,50.71 98.68,51.38 v99.14,51.38
D27  (via drill 0.35, 0.41)
  Top 0.25: U1.P$73 53.36,82.45 53.79,82.88 53.79,82.99 54,83.2 | 54,83.2 54.2,83.4 | 54,83.2 v54.32,83.28 | LCD_HEADER.7 59.99,32.78 59.05,33.72 58.18,33.72 56.67,35.23 56.67,35.86 56.03,36.5 55.4,36.5 52.2,39.7 52.2,41.1 48.07,45.23 48.07,50.28 48.38,50.58 v48.38,51.11
  Bottom 0.25: v54.32,83.28 54.9,82.7 54.9,80.98 55.24,80.63 55.24,80.03 54.81,79.59 54.7,79.59 53.7,78.59 51.88,78.59 47.88,74.59 46.51,74.59 45.01,73.08 45.01,65.49 48.17,62.33 48.17,55.88 49.62,54.42 49.62,52.78 48.38,51.54 v48.38,51.11
D28
  Top 0.25: U1.P$72 51.2,80.96 51.2,80.15 53.81,77.55 66.62,77.55 72.27,71.91 72.91,71.91 74.55,70.27 74.55,67.79 81.08,61.25 81.08,53.94 81.54,53.48 85.68,53.48 85.7,53.5 88.4,53.5 JP4.5 92.08,54.95 92.5,54.54 92.5,54.32 92.66,54.16 U$3.CSN_CFG3
D29  (via drill 0.35)
  Top 0.25: U1.P$71 52.7,83.12 53.6,84.02 55.01,84.02 v55.11,84.11 | LCD_HEADER.8 62.95,32.78 61.86,33.88 60.23,33.88 59.21,34.89 59.21,35.86 58.58,36.5 57.6,36.5 56.67,37.43 56.67,38.4 56.03,39.04 55.06,39.04 54.4,39.7 53.2,39.7 52.65,40.25 52.65,41.29 48.53,45.41 48.53,50.09 49.38,50.94 v49.38,51.44
  Bottom 0.25: v55.11,84.11 55.37,83.86 55.37,81.16 55.7,80.82 55.7,79.84 54,78.14 52.07,78.14 48.07,74.14 46.7,74.14 45.46,72.9 45.46,65.68 48.62,62.52 48.62,56.1 50.12,54.6 50.12,52.52 49.63,52.03 49.63,51.7 v49.38,51.44
D30  (via drill 0.3, 0.3 pad 0.35, 0.35)